# EAGLE design NodeMCU_Extn (EAGLE 7.7.0)
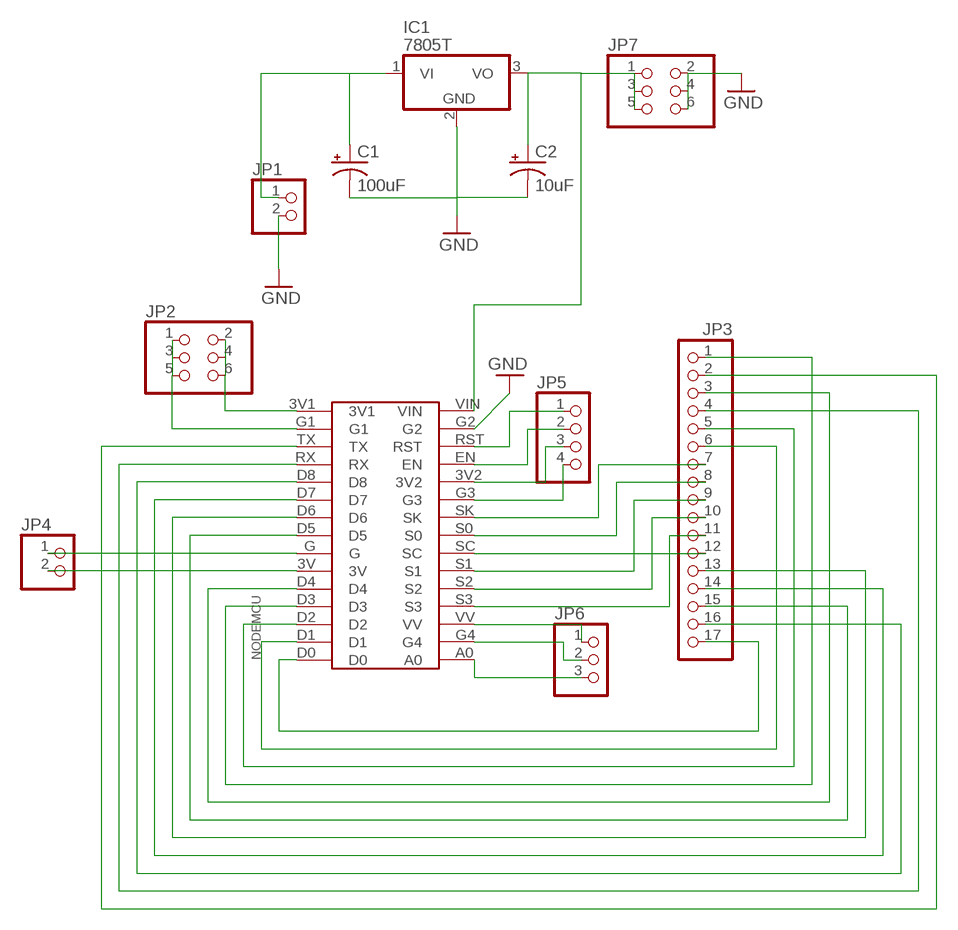
[diagram p0: schematic, sheet 1]

## Parts
C1  100uF  10UF-POLAR-RADIAL-2.5MM-25V-20%  [CPOL-RADIAL-2.5MM-5MM]
C2  10uF  10UF-POLAR-RADIAL-2.5MM-25V-20%  [CPOL-RADIAL-2.5MM-5MM]
IC1  7805T  [TO220H]
JP1  PINHD-1X2  [1X02]
JP2  PINHD-2X3  [2X03]
JP3  PINHD-1X17  [1X17]
JP4  PINHD-1X2  [1X02]
JP5  PINHD-1X4  [1X04]
JP6  PINHD-1X3  [1X03]
JP7  PINHD-2X3  [2X03]
NODEMCU  LOLIN  [LOLIN]

## Nets
3V3: JP2.2 JP2.4 JP2.6 NODEMCU.3V1
5V: C2.1(+) IC1.3(VO) JP7.1 JP7.3 JP7.5 NODEMCU.VIN
9V: C1.1(+) IC1.1(VI) JP1.1
A0: JP6.3 NODEMCU.A0
EN: JP5.2 NODEMCU.EN
G_MCU: JP2.1 JP2.3 JP2.5 NODEMCU.G1
GND: C1.2(-) C2.2(-) IC1.2(GND) JP1.2 JP7.2 JP7.4 JP7.6 NODEMCU.G2
IO0: JP3.1 NODEMCU.D3
IO1: JP3.2 NODEMCU.TX
IO2: JP3.3 NODEMCU.D4
IO3: JP3.4 NODEMCU.RX
IO4: JP3.5 NODEMCU.D2
IO5: JP3.6 NODEMCU.D1
IO6: JP3.7 NODEMCU.SK
IO7: JP3.8 NODEMCU.S0
IO8: JP3.9 NODEMCU.S1
IO9: JP3.10 NODEMCU.S2
IO10: JP3.11 NODEMCU.S3
IO11: JP3.12 NODEMCU.SC
IO12: JP3.13 NODEMCU.D6
IO13: JP3.14 NODEMCU.D7
IO14: JP3.15 NODEMCU.D5
IO15: JP3.16 NODEMCU.D8
IO16: JP3.17 NODEMCU.D0
N$1: JP4.1 NODEMCU.G
N$2: JP4.2 NODEMCU.3V
N$3: JP5.4 NODEMCU.G3
N$4: JP6.1 NODEMCU.VV
N$5: JP6.2 NODEMCU.G4
N$6: JP5.3 NODEMCU.3V2
RST: JP5.1 NODEMCU.RST

## Library data of the parts
C1 = SparkFun-Capacitors:10UF-POLAR: 10.0µF polarized capacitors A capacitor is a passive two-terminal electrical component used to store electrical energy temporarily in an electric field.; PROD_ID: CAP-08440; VALUE: 10uF
C2 = SparkFun-Capacitors:10UF-POLAR: 10.0µF polarized capacitors A capacitor is a passive two-terminal electrical component used to store electrical energy temporarily in an electric field.; PROD_ID: CAP-08440
IC1 = linear:78*: Positive VOLTAGE REGULATOR Source: http://cache.national.com/ds/LM/LM78L05.pdf http://www.fairchildsemi.com/ds/LM/LM7805.pdf
JP1 JP4 = pinhead:PINHD-1X2: PIN HEADER
JP2 JP7 = pinhead:PINHD-2X3: PIN HEADER
JP3 = pinhead:PINHD-1X17: PIN HEADER
JP5 = pinhead:PINHD-1X4: PIN HEADER
JP6 = pinhead:PINHD-1X3: PIN HEADER
NODEMCU = Lolin:LOLIN

## Board
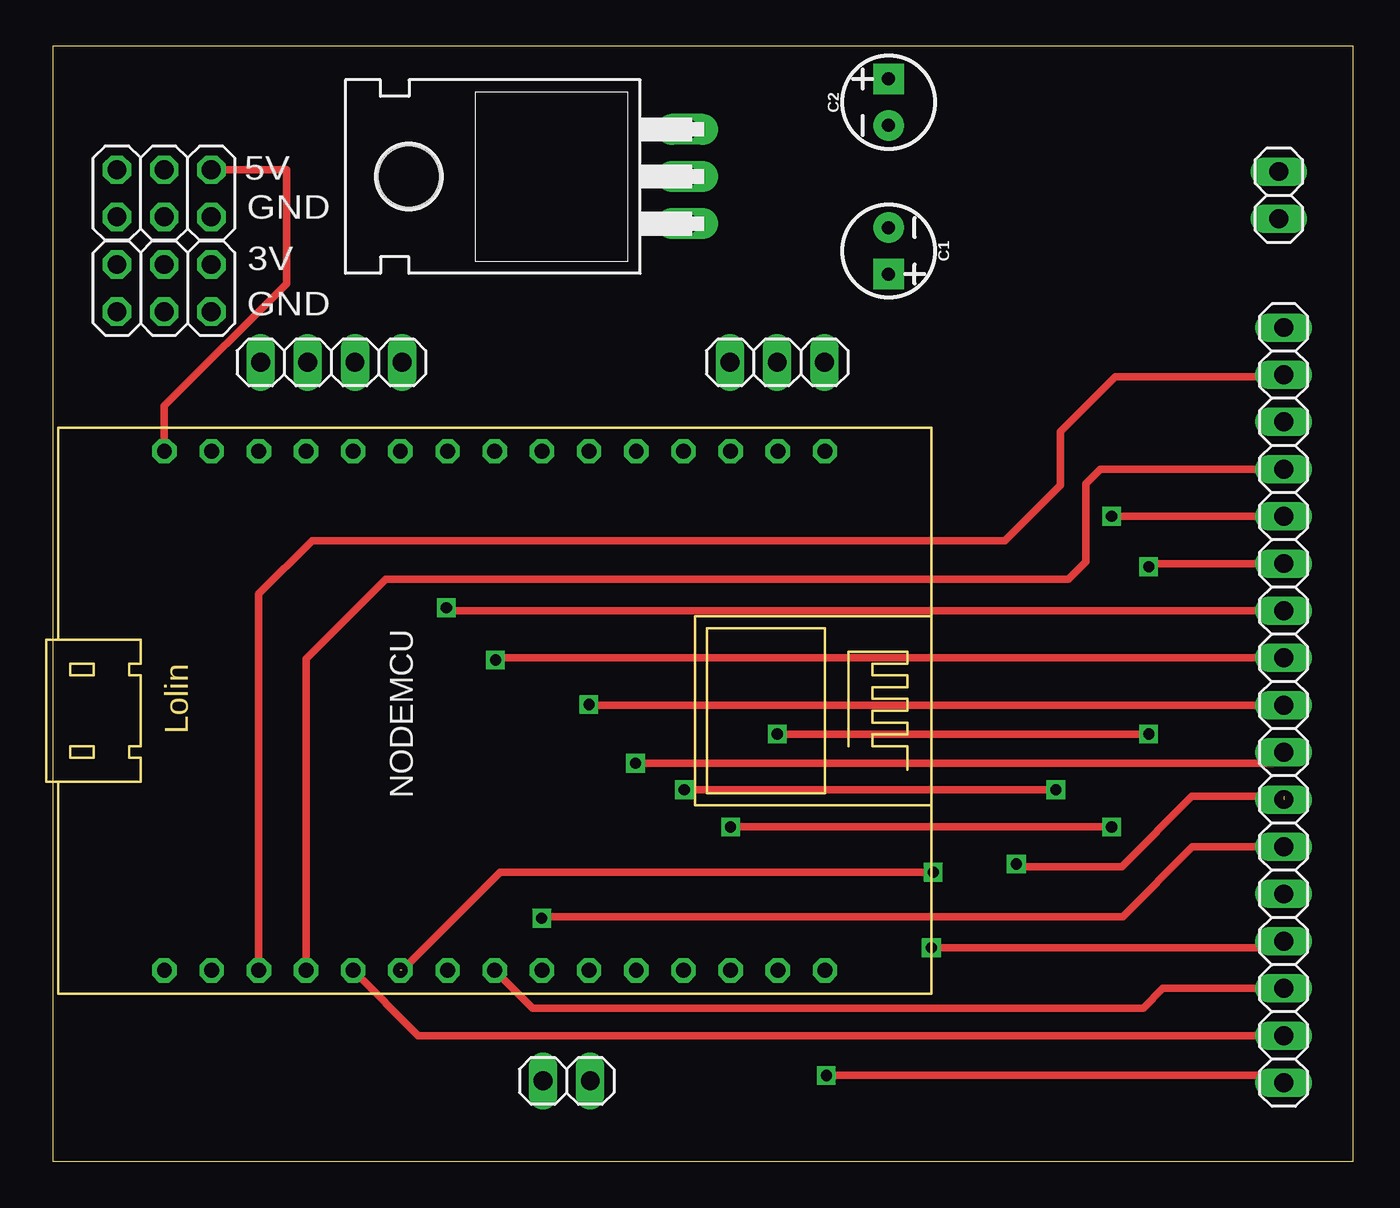
[diagram p1: board, top side]
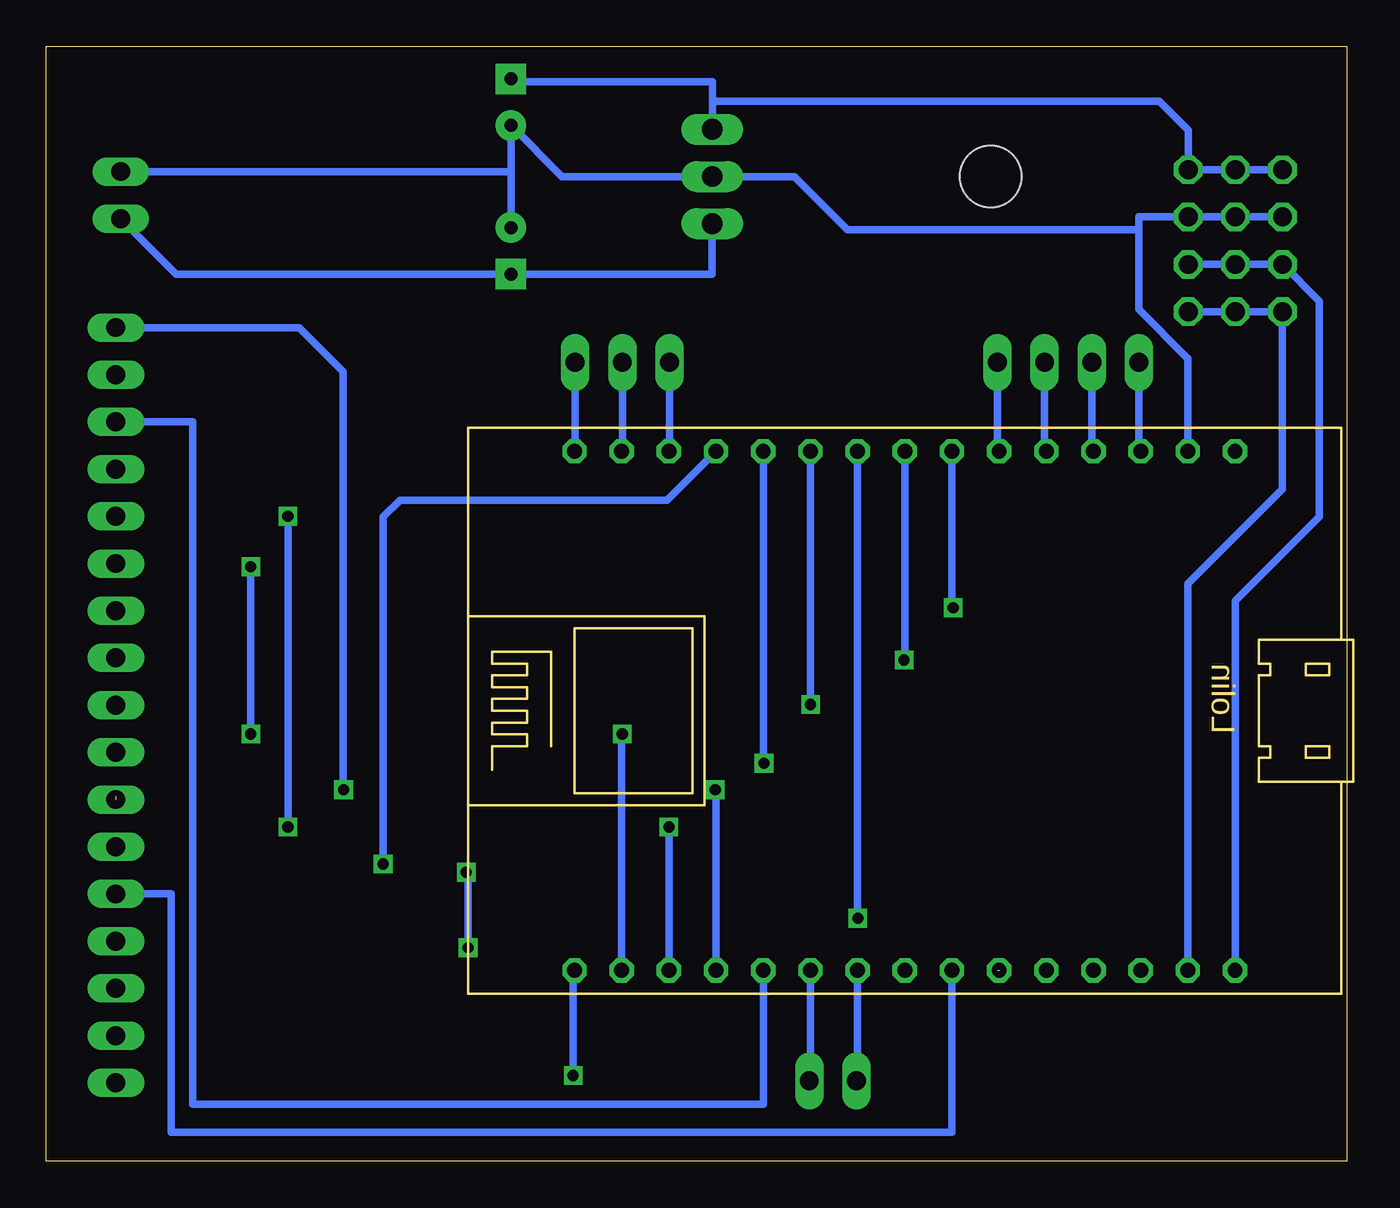
[diagram p2: board, bottom side, seen from below]

Size 70 x 60 mm. Coordinates in mm from the lower left corner, seen from the top.
Outline: 0,0 70,0 70,60 0,60 0,0
Copper layers (1*16): Top 0.035mm / dielectric 1.5mm / Bottom 0.035mm
Design rules "default *": minimum track width 10mil, minimum drill 24mil, track to track 8mil, track to pad 8mil, pad to pad 8mil, via to via 8mil, smd to smd 8mil, copper to edge 40mil, drill to drill 8mil, minimum pad ring 10mil, minimum via ring 8mil, stop-mask expansion 4mil, vias tented up to drill 0mil, thermal gap 10mil

### Footprints (pad centres in the part's own frame; a part is rotated, then mirrored left to right if it is on the bottom)
CPOL-RADIAL-2.5MM-5MM = drill 0.7 pad 1.651 square: 1 1.25,0 | drill 0.7 pad 1.651: 2 -1.25,0
TO220H = drill 1.118 long: 1 -2.54,-10.16; 2 0,-10.16; 3 2.54,-10.16 | hole 3.302: 0,4.826
1X02 = drill 1.016 long: 1 -1.27,0; 2 1.27,0
2X03 = drill 1.016 octagon: 1 -2.54,-1.27; 2 -2.54,1.27; 3 0,-1.27; 4 0,1.27; 5 2.54,-1.27; 6 2.54,1.27
1X17 = drill 1.016 long: 1 -20.32,0; 2 -17.78,0; 3 -15.24,0; 4 -12.7,0; 5 -10.16,0; 6 -7.62,0; 7 -5.08,0; 8 -2.54,0; 9 0,0; 10 2.54,0; 11 5.08,0; 12 7.62,0; 13 10.16,0; 14 12.7,0; 15 15.24,0; 16 17.78,0; 17 20.32,0
1X04 = drill 1.016 long: 1 -3.81,0; 2 -1.27,0; 3 1.27,0; 4 3.81,0
1X03 = drill 1.016 long: 1 -2.54,0; 2 0,0; 3 2.54,0
LOLIN = drill 0.8 octagon: 3V -6.35,13.97; 3V1 16.51,13.97; 3V2 6.35,-13.97; A0 -19.05,-13.97; D0 -19.05,13.97; D1 -16.51,13.97; D2 -13.97,13.97; D3 -11.43,13.97; D4 -8.89,13.97; D5 -1.27,13.97; D6 1.27,13.97; D7 3.81,13.97; D8 6.35,13.97; EN 8.89,-13.97; G -3.81,13.97; G1 13.97,13.97; G2 13.97,-13.97; G3 3.81,-13.97; G4 -16.51,-13.97; RST 11.43,-13.97; RX 8.89,13.97; S0 -1.27,-13.97; S1 -6.35,-13.97; S2 -8.89,-13.97; S3 -11.43,-13.97; SC -3.81,-13.97; SK 1.27,-13.97; TX 11.43,13.97; VIN 16.51,-13.97; VV -13.97,-13.97

### Placement (x,y rotation side)
C1  45,49 270 top
C2  45,57 90 top
IC1  24,53 90 top
JP1  66,52 90 top
JP2  6,47 0 top
JP3  66.26,24.56 270 top
JP4  27.67,4.34 0 top
JP5  15,43 0 top
JP6  39,43 0 top
JP7  6,52.1 180 top
NODEMCU  22.53,24.25 180 top

### Tracks (layer width: path | path; a pad name or v marks a point on that pad's centre or on a via)
3V3
  Bottom 0.406: JP2.6 JP2.4 JP2.2 1.49,46.3 1.49,34.69 6.01,30.16 NODEMCU.3V1
5V
  Top 0.406: NODEMCU.VIN 6.01,40.66 12.58,47.23 12.58,53.37 JP7.1
  Bottom 0.406: JP7.5 JP7.3 JP7.1 8.54,55.5 10.1,57.05 33.98,57.05 34.14,56.9 | C2.1 45,58.11 34.14,58.11 34.14,56.9 | 34.14,56.9 34.14,55.54 IC1.3
9V
  Bottom 0.406: IC1.1 34.16,47.75 C1.1 63.02,47.75 JP1.1
A0
  Bottom 0.406: NODEMCU.A0 41.54,38.22 JP6.3
EN
  Bottom 0.406: NODEMCU.EN 13.73,38.22 JP5.2
G_MCU
  Bottom 0.406: JP2.5 JP2.3 JP2.1 | 3.37,45.73 JP2.1 | NODEMCU.G1 8.55,31.09 3.46,36.18 JP2.1
GND
  Bottom 0.406: JP7.6 JP7.4 JP7.2 11.2,50.83 11.2,50.14 | 11.2,50.14 11.2,45.85 8.58,43.23 8.55,43.23 NODEMCU.G2 | C2.2 C1.2 | C2.2 45,53.27 JP1.2 | C2.2 42.25,53 IC1.2 29.74,53 26.88,50.14 11.2,50.14
IO0  (via drill 0.6)
  Top 0.406: v34,20 v54,20
  Bottom 0.406: NODEMCU.D3 33.95,20 v34,20 | JP3.1 56.39,44.88 54.02,42.5 54.02,20.02 v54,20
IO1
  Top 0.406: NODEMCU.TX 11.1,30.54 13.96,33.41 51.27,33.41 54.24,36.38 54.24,39.26 57.21,42.23 66.15,42.23 JP3.2
IO2
  Bottom 0.406: NODEMCU.D4 31.41,3.09 62.12,3.09 62.12,39.8 JP3.3
IO3
  Top 0.406: NODEMCU.RX 13.63,27.04 17.91,31.32 54.67,31.32 55.61,32.27 55.61,36.46 56.41,37.26 JP3.4
IO4  (via drill 0.6)
  Top 0.406: v36.49,18 v57,18 | v57,34.72 JP3.5
  Bottom 0.406: v57,18 v57,34.72 | v36.49,18 NODEMCU.D2
IO5  (via drill 0.6)
  Top 0.406: v39,23 v59,23 | v59,32 59,32.18 JP3.6
  Bottom 0.406: NODEMCU.D1 39.03,23 v39,23 | v59,23 v59,32
IO6  (via drill 0.6)
  Top 0.406: JP3.7 21.2,29.64 v21.2,29.79
  Bottom 0.406: v21.2,29.79 21.25,29.79 NODEMCU.SK
IO7  (via drill 0.6)
  Top 0.406: JP3.8 23.83,27.1 v23.83,26.99
  Bottom 0.406: v23.83,26.99 23.8,26.99 NODEMCU.S0
IO8  (via drill 0.6)
  Top 0.406: JP3.9 28.86,24.56 v28.86,24.59
  Bottom 0.406: v28.86,24.59 28.88,24.59 NODEMCU.S1
IO9  (via drill 0.6)
  Top 0.406: JP3.10 65.68,21.43 v31.38,21.43
  Bottom 0.406: v31.38,21.43 31.41,21.43 NODEMCU.S2
IO10  (via drill 0.6)  (1 unrouted)
  Top 0.406: 66.26,19.64 61.32,19.64 57.55,15.87 52.01,15.87 v51.87,16.01
  Bottom 0.406: v51.87,16.01 51.87,34.69 50.97,35.59 36.59,35.59 NODEMCU.S3
IO11  (via drill 0.6)
  Top 0.406: 26.32,13.18 v26.32,13.09 26.42,13.18 57.6,13.18 61.36,16.94 JP3.12
  Bottom 0.406: NODEMCU.SC 26.34,13.09 v26.32,13.09
IO12
  Bottom 0.406: NODEMCU.D6 21.25,1.57 63.27,1.57 63.27,14.4 JP3.13
IO13  (via drill 0.6)  (1 unrouted)
  Top 0.406: JP3.14 66.26,11.5 v47.3,11.5 | 47.4,15.66 v47.4,15.56 24.08,15.56 18.8,10.28
  Bottom 0.406: v47.3,11.5 47.3,15.56 v47.4,15.56
IO14
  Top 0.406: JP3.15 59.77,9.32 58.7,8.25 25.82,8.25 NODEMCU.D5
IO15
  Top 0.406: NODEMCU.D8 19.68,6.78 JP3.16
IO16  (via drill 0.6)
  Top 0.406: JP3.17 66.26,4.63 v41.65,4.63
  Bottom 0.406: v41.65,4.63 41.65,10.28 NODEMCU.D0
N$1
  Bottom 0.406: NODEMCU.G 26.34,4.34 JP4.1
N$2
  Bottom 0.406: NODEMCU.3V 28.88,4.34 JP4.2
N$3
  Bottom 0.406: NODEMCU.G3 18.81,38.22 JP5.4
N$4
  Bottom 0.406: NODEMCU.VV 36.46,38.22 JP6.1
N$5
  Bottom 0.406: NODEMCU.G4 39,38.22 JP6.2
N$6
  Bottom 0.406: NODEMCU.3V2 16.27,38.22 JP5.3
RST
  Bottom 0.406: NODEMCU.RST 11.19,38.22 JP5.1

### Text on the board
tPlace: 5V | GND | 3V | GND
tValues: G | 9V | 0 / 1 / 2 / 3 / 4 / 5 / 6 / 7 / 8 / 9 / 10 / 11 / 12 / 13 / 14 / 15 / 16 | NodeMCU / Extender v1.0
bStop: Node Trainer v1.0 | Node Trainer v1.0